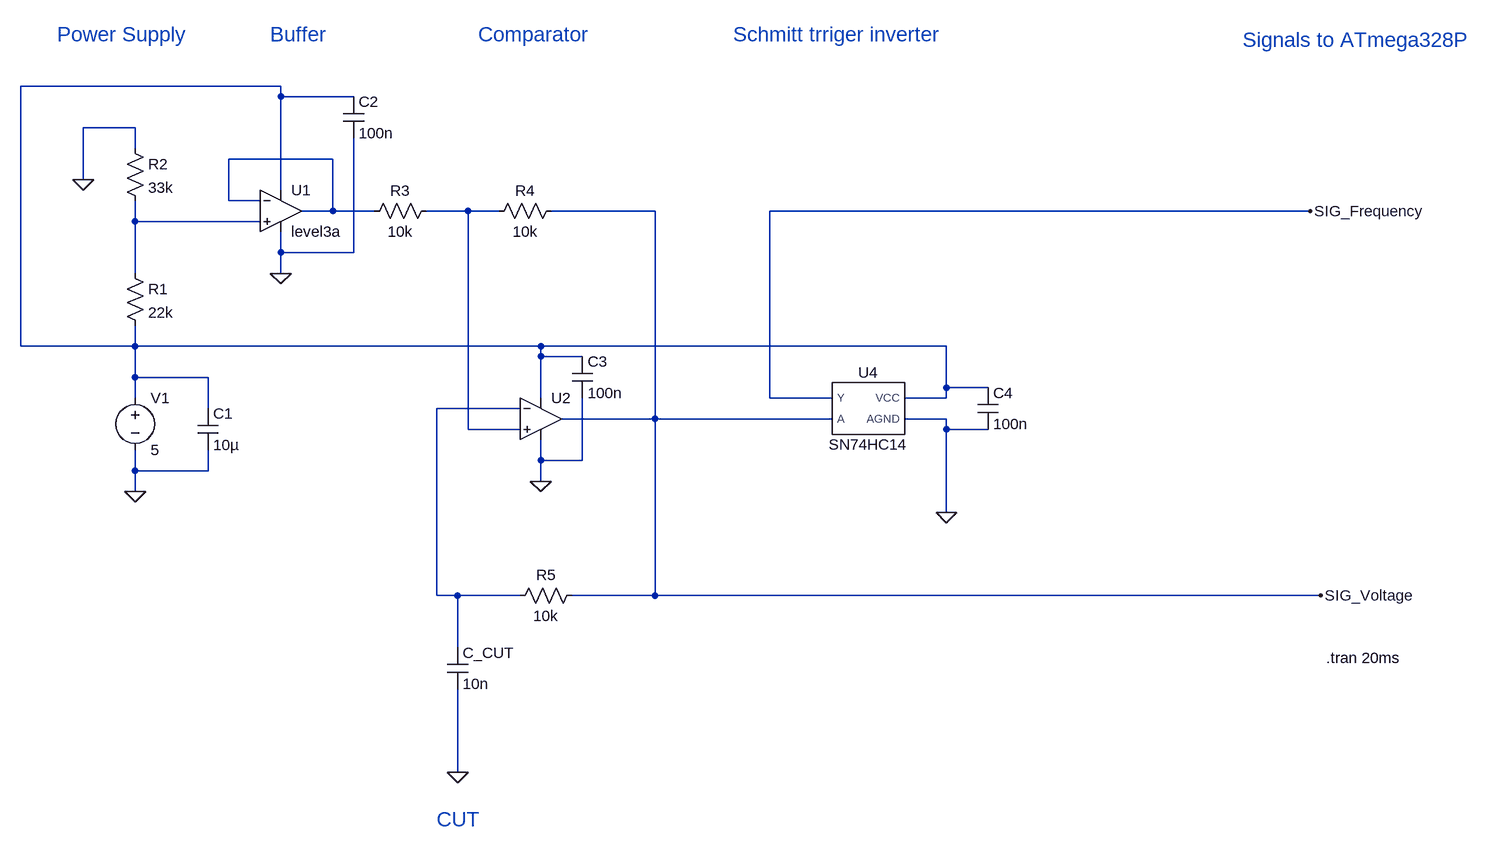
[diagram p0: schematic Identifier_C.asc]
Identifier_C.asc, the LTspice schematic file:
Version 4.1
SHEET 1 2120 1196
WIRE 272 -352 -128 -352
WIRE 272 -336 272 -352
WIRE 384 -336 272 -336
WIRE 48 -288 -32 -288
WIRE 48 -256 48 -288
WIRE 352 -240 192 -240
WIRE -32 -208 -32 -288
WIRE 272 -192 272 -336
WIRE 192 -176 192 -240
WIRE 240 -176 192 -176
WIRE 352 -160 352 -240
WIRE 352 -160 304 -160
WIRE 416 -160 352 -160
WIRE 560 -160 496 -160
WIRE 608 -160 560 -160
WIRE 848 -160 688 -160
WIRE 1856 -160 1024 -160
WIRE 48 -144 48 -176
WIRE 240 -144 48 -144
WIRE 272 -96 272 -128
WIRE 384 -96 384 -272
WIRE 384 -96 272 -96
WIRE 48 -64 48 -144
WIRE 272 -64 272 -96
WIRE -128 48 -128 -352
WIRE 48 48 48 16
WIRE 48 48 -128 48
WIRE 672 48 48 48
WIRE 1296 48 672 48
WIRE 672 64 672 48
WIRE 736 64 672 64
WIRE 48 96 48 48
WIRE 160 96 48 96
WIRE 1296 112 1296 48
WIRE 1360 112 1296 112
WIRE 48 128 48 96
WIRE 672 128 672 64
WIRE 1024 128 1024 -160
WIRE 1120 128 1024 128
WIRE 1296 128 1296 112
WIRE 1296 128 1232 128
WIRE 160 144 160 96
WIRE 640 144 512 144
WIRE 848 160 848 -160
WIRE 848 160 704 160
WIRE 1120 160 848 160
WIRE 1296 160 1232 160
WIRE 560 176 560 -160
WIRE 640 176 560 176
WIRE 1296 176 1296 160
WIRE 1360 176 1296 176
WIRE 672 224 672 192
WIRE 736 224 736 128
WIRE 736 224 672 224
WIRE 48 240 48 208
WIRE 160 240 160 208
WIRE 160 240 48 240
WIRE 672 256 672 224
WIRE 48 272 48 240
WIRE 1296 304 1296 176
WIRE 512 432 512 144
WIRE 544 432 512 432
WIRE 640 432 544 432
WIRE 848 432 848 160
WIRE 848 432 720 432
WIRE 1872 432 848 432
WIRE 544 512 544 432
WIRE 544 704 544 576
FLAG 48 272 0
FLAG -32 -208 0
FLAG 272 -64 0
FLAG 672 256 0
FLAG 544 704 0
FLAG 1296 304 0
FLAG 1856 -160 SIG_Frequency
FLAG 1872 432 SIG_Voltage
SYMBOL voltage 48 112 R0
WINDOW 123 0 0 Left 0
WINDOW 39 0 0 Left 0
SYMATTR InstName V1
SYMATTR Value 5
SYMBOL res 32 -80 R0
SYMATTR InstName R1
SYMATTR Value 22k
SYMBOL cap 144 144 R0
SYMATTR InstName C1
SYMATTR Value 10µ
SYMBOL res 32 -272 R0
SYMATTR InstName R2
SYMATTR Value 33k
SYMBOL OpAmps\\UniversalOpAmp3 272 -160 R0
SYMATTR InstName U1
SYMBOL cap 368 -336 R0
SYMATTR InstName C2
SYMATTR Value 100n
SYMBOL res 512 -176 R90
WINDOW 0 0 56 VBottom 2
WINDOW 3 32 56 VTop 2
SYMATTR InstName R3
SYMATTR Value 10k
SYMBOL res 704 -176 R90
WINDOW 0 0 56 VBottom 2
WINDOW 3 32 56 VTop 2
SYMATTR InstName R4
SYMATTR Value 10k
SYMBOL OpAmps\\UniversalOpAmp2 672 160 R0
SYMATTR InstName U2
SYMBOL res 736 416 R90
WINDOW 0 0 56 VBottom 2
WINDOW 3 32 56 VTop 2
SYMATTR InstName R5
SYMATTR Value 10k
SYMBOL cap 720 64 R0
SYMATTR InstName C3
SYMATTR Value 100n
SYMBOL SN74HC14 1168 144 R0
SYMATTR InstName U4
SYMBOL cap 1344 112 R0
SYMATTR InstName C4
SYMATTR Value 100n
SYMBOL cap 528 512 R0
SYMATTR InstName C_CUT
SYMATTR Value 10n
TEXT 1880 528 Left 2 !.tran 20ms
TEXT -72 -432 Left 3 ;Power Supply
TEXT 256 -432 Left 3 ;Buffer
TEXT 576 -432 Left 3 ;Comparator
TEXT 968 -432 Left 3 ;Schmitt trriger inverter
TEXT 512 776 Left 3 ;CUT
TEXT 1752 -424 Left 3 ;Signals to ATmega328P

The netlist it stands for:
* Identifier_C.asc
V1 N001 0 5
R1 N004 N001 22k
C1 N001 0 10µ
R2 0 N004 33k
X§U1 N004 N002 N001 0 N002 level3a  ; pins In+ In- V+ V- OUT
C2 N001 0 100n
R3 N003 N002 10k
R4 SIG_Voltage N003 10k
X§U2 N003 N005 N001 0 SIG_Voltage level2 Avol=1Meg GBW=10Meg Slew=10Meg Ilimit=25m Rail=0 Vos=0 En=0 Enk=0 In=0 Ink=0 Rin=500Meg  ; pins In+ In- V+ V- OUT
R5 SIG_Voltage N005 10k
C3 N001 0 100n
X§U4 SIG_Frequency SIG_Voltage N001 0 SN74HC14  ; pins Y A VCC AGND
C4 N001 0 100n
C_CUT N005 0 10n
.tran 20ms
* Power Supply
* Buffer
* Comparator
* Schmitt trriger inverter
* CUT
* Signals to ATmega328P
.lib UniversalOpAmp2.lib
.lib SN74HC14.cir
.backanno
.end